# EAGLE schematic bot.1 (EAGLE 9.6.2)
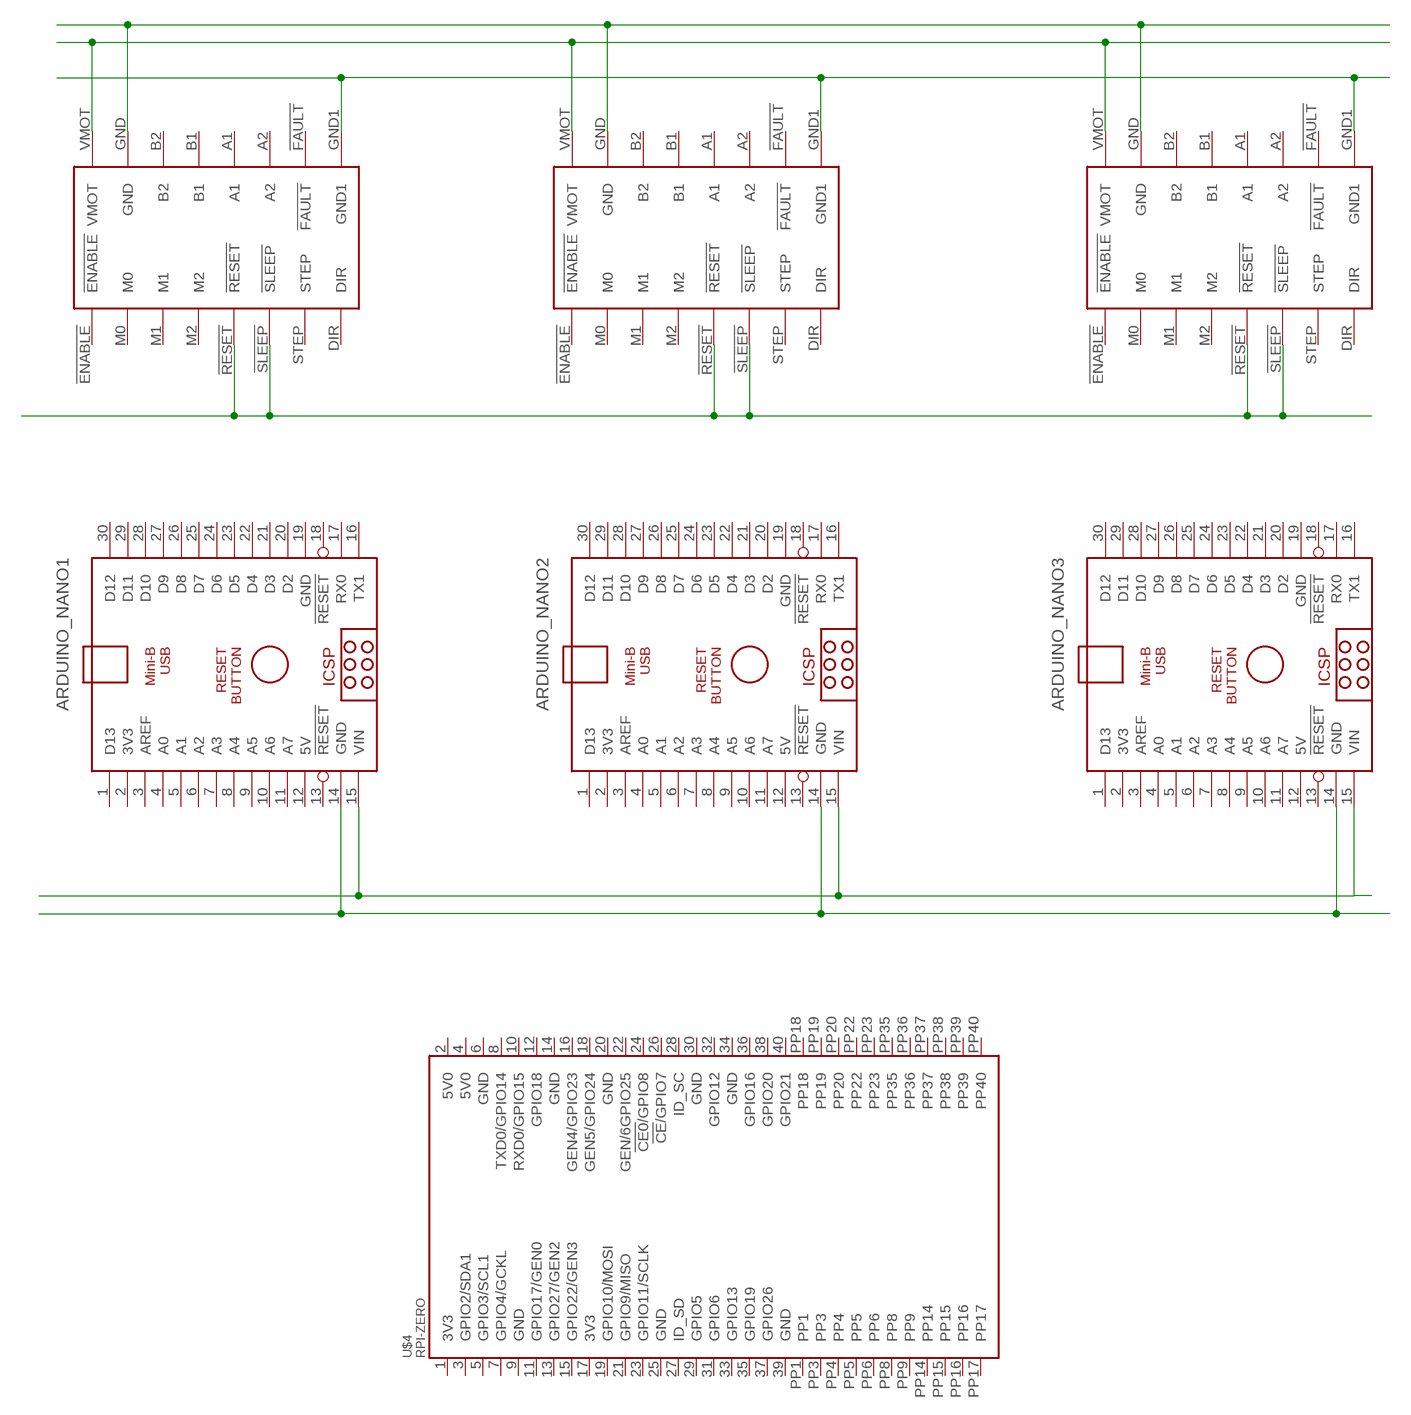
[diagram p0: schematic, sheet 1]

## Parts
ARDUINO_NANO1  ARDUINO_NANO  [ARDUINO_NANO]
ARDUINO_NANO2  ARDUINO_NANO  [ARDUINO_NANO]
ARDUINO_NANO3  ARDUINO_NANO  [ARDUINO_NANO]
U$1  DRV8825  [DRV8825]
U$2  DRV8825  [DRV8825]
U$3  DRV8825  [DRV8825]
U$4  RPI-ZERO  [RASP_PI_ZERO_BOARD_FULL]

## Nets
N$1: ARDUINO_NANO1.14(GND) ARDUINO_NANO2.14(GND) ARDUINO_NANO3.14(GND)
N$2: ARDUINO_NANO1.15(VIN) ARDUINO_NANO2.15(VIN) ARDUINO_NANO3.15(VIN)
N$3: U$1.!RESET U$1.!SLEEP U$2.!RESET U$2.!SLEEP U$3.!RESET U$3.!SLEEP
N$4: U$1.VMOT U$2.VMOT U$3.VMOT
N$5: U$1.GND U$2.GND U$3.GND
N$6: U$1.GND1 U$2.GND1 U$3.GND1
Unconnected: ARDUINO_NANO1.1(D13) ARDUINO_NANO1.2(3V3) ARDUINO_NANO1.3(AREF) ARDUINO_NANO1.4(A0) ARDUINO_NANO1.5(A1) ARDUINO_NANO1.6(A2) ARDUINO_NANO1.7(A3) ARDUINO_NANO1.8(A4) ARDUINO_NANO1.9(A5) ARDUINO_NANO1.10(A6) ARDUINO_NANO1.11(A7) ARDUINO_NANO1.13(!RESET) ARDUINO_NANO1.16(TX1) ARDUINO_NANO1.17(RX0) ARDUINO_NANO1.18(!RESET) ARDUINO_NANO1.20(D2) ARDUINO_NANO1.21(D3) ARDUINO_NANO1.22(D4) ARDUINO_NANO1.23(D5) ARDUINO_NANO1.24(D6) ARDUINO_NANO1.25(D7) ARDUINO_NANO1.26(D8) ARDUINO_NANO1.27(D9) ARDUINO_NANO1.28(D10) ARDUINO_NANO1.29(D11) ARDUINO_NANO1.30(D12) ARDUINO_NANO2.1(D13) ARDUINO_NANO2.2(3V3) ARDUINO_NANO2.3(AREF) ARDUINO_NANO2.4(A0) ARDUINO_NANO2.5(A1) ARDUINO_NANO2.6(A2) ARDUINO_NANO2.7(A3) ARDUINO_NANO2.8(A4) ARDUINO_NANO2.9(A5) ARDUINO_NANO2.10(A6) ARDUINO_NANO2.11(A7) ARDUINO_NANO2.13(!RESET) ARDUINO_NANO2.16(TX1) ARDUINO_NANO2.17(RX0) ARDUINO_NANO2.18(!RESET) ARDUINO_NANO2.20(D2) ARDUINO_NANO2.21(D3) ARDUINO_NANO2.22(D4) ARDUINO_NANO2.23(D5) ARDUINO_NANO2.24(D6) ARDUINO_NANO2.25(D7) ARDUINO_NANO2.26(D8) ARDUINO_NANO2.27(D9) ARDUINO_NANO2.28(D10) ARDUINO_NANO2.29(D11) ARDUINO_NANO2.30(D12) ARDUINO_NANO3.1(D13) ARDUINO_NANO3.2(3V3) ARDUINO_NANO3.3(AREF) ARDUINO_NANO3.4(A0) ARDUINO_NANO3.5(A1) ARDUINO_NANO3.6(A2) ARDUINO_NANO3.7(A3) ARDUINO_NANO3.8(A4) ARDUINO_NANO3.9(A5) ARDUINO_NANO3.10(A6) ARDUINO_NANO3.11(A7) ARDUINO_NANO3.13(!RESET) ARDUINO_NANO3.16(TX1) ARDUINO_NANO3.17(RX0) ARDUINO_NANO3.18(!RESET) ARDUINO_NANO3.20(D2) ARDUINO_NANO3.21(D3) ARDUINO_NANO3.22(D4) ARDUINO_NANO3.23(D5) ARDUINO_NANO3.24(D6) ARDUINO_NANO3.25(D7) ARDUINO_NANO3.26(D8) ARDUINO_NANO3.27(D9) ARDUINO_NANO3.28(D10) ARDUINO_NANO3.29(D11) ARDUINO_NANO3.30(D12) U$1.!ENABLE U$1.!FAULT U$1.A1 U$1.A2 U$1.B1 U$1.B2 U$1.DIR U$1.M0 U$1.M1 U$1.M2 U$1.STEP U$2.!ENABLE U$2.!FAULT U$2.A1 U$2.A2 U$2.B1 U$2.B2 U$2.DIR U$2.M0 U$2.M1 U$2.M2 U$2.STEP U$3.!ENABLE U$3.!FAULT U$3.A1 U$3.A2 U$3.B1 U$3.B2 U$3.DIR U$3.M0 U$3.M1 U$3.M2 U$3.STEP U$4.1(3V3) U$4.2(5V0) U$4.3(GPIO2/SDA1) U$4.4(5V0) U$4.5(GPIO3/SCL1) U$4.6(GND) U$4.7(GPIO4/GCKL) U$4.8(TXD0/GPIO14) U$4.9(GND) U$4.10(RXD0/GPIO15) U$4.11(GPIO17/GEN0) U$4.12(GPIO18) U$4.13(GPIO27/GEN2) U$4.14(GND) U$4.15(GPIO22/GEN3) U$4.16(GEN4/GPIO23) U$4.17(3V3) U$4.18(GEN5/GPIO24) U$4.19(GPIO10/MOSI) U$4.20(GND) U$4.21(GPIO9/MISO) U$4.22(GEN/6GPIO25) U$4.23(GPIO11/SCLK) U$4.24(!CE0!/GPIO8) U$4.25(GND) U$4.26(!CE!/GPIO7) U$4.27(ID_SD) U$4.28(ID_SC) U$4.29(GPIO5) U$4.30(GND) U$4.31(GPIO6) U$4.32(GPIO12) U$4.33(GPIO13) U$4.34(GND) U$4.35(GPIO19) U$4.36(GPIO16) U$4.37(GPIO26) U$4.38(GPIO20) U$4.39(GND) U$4.40(GPIO21) U$4.PP1 U$4.PP3 U$4.PP4 U$4.PP5 U$4.PP6 U$4.PP8 U$4.PP9 U$4.PP14 U$4.PP15 U$4.PP16 U$4.PP17 U$4.PP18 U$4.PP19 U$4.PP20 U$4.PP22 U$4.PP23 U$4.PP35 U$4.PP36 U$4.PP37 U$4.PP38 U$4.PP39 U$4.PP40

## Power pins joined to a net without a drawn wire
5V: ARDUINO_NANO1.12(5V) ARDUINO_NANO2.12(5V) ARDUINO_NANO3.12(5V)
GND: ARDUINO_NANO1.19(GND) ARDUINO_NANO2.19(GND) ARDUINO_NANO3.19(GND)

## Library data of the parts
ARDUINO_NANO1-ARDUINO_NANO3 = ArduinoNanoV30:ARDUINO_NANO: Arduino Nano V3.0 Overview: The Arduino Nano is a small, complete, and breadboard-friendly board based on the ATmega328 (Arduino Nano 3.x) or ATmega168 (Arduino Nano 2.x). It has more or less the same functionality of the Arduino Duemilanove, but in a different package. It lacks only a DC power jack, and works with a Mini-B USB cable instead of a standard one. The Nano was designed and is being produced by Gravitech. Specifications: Microcontroller Atmel ATmega168 or ATmega328 Operating Voltage (logic level) 5 V Input Voltage (recommended) 7-12 V Input Voltage (limits) 6-20 V Digital I/O Pins 14 (of which 6 provide PWM output) Analog Input Pins 8 DC Current per I/O Pin 40 mA Flash Memory 16 KB (ATmega168) or 32 KB (ATmega328) of which 2 KB used by bootloader SRAM 1 KB (ATmega168) or 2 KB (ATmega328) EEPROM 512 bytes (ATmega168) or 1 KB (ATmega328) Clock Speed 16 MHz Dimensions 0.73" x 1.70" Length 45 mm Width 18 mm Weigth 5 g Power: The Arduino Nano can be powered via the Mini-B USB connection, 6-20V unregulated external power supply (pin 30), or 5V regulated external power supply (pin 27). The power source is automatically selected to the highest voltage source. Memory: The ATmega168 has 16 KB of flash memory for storing code (of which 2 KB is used for the bootloader); the ATmega328 has 32 KB, (also with 2 KB used for the bootloader). The ATmega168 has 1 KB of SRAM and 512 bytes of EEPROM (which can be read and written with the EEPROM library); the ATmega328 has 2 KB of SRAM and 1 KB of EEPROM. Input and Output: Each of the 14 digital pins on the Nano can be used as an input or output, using pinMode(), digitalWrite(), and digitalRead() functions. They operate at 5 volts. Each pin can provide or receive a maximum of 40 mA and has an internal pull-up resistor (disconnected by default) of 20-50 kOhms. In addition, some pins have specialized functions. Visit Arduino - ArduinoBoardNano <https://www.arduino.cc/en/Main/ArduinoBoardNano>
U$1-U$3 = DRV8825:DRV8825
U$4 = rpi-zero:RPI-ZERO